# Altium schematic sheet STM and connectors.SchDoc
size A4
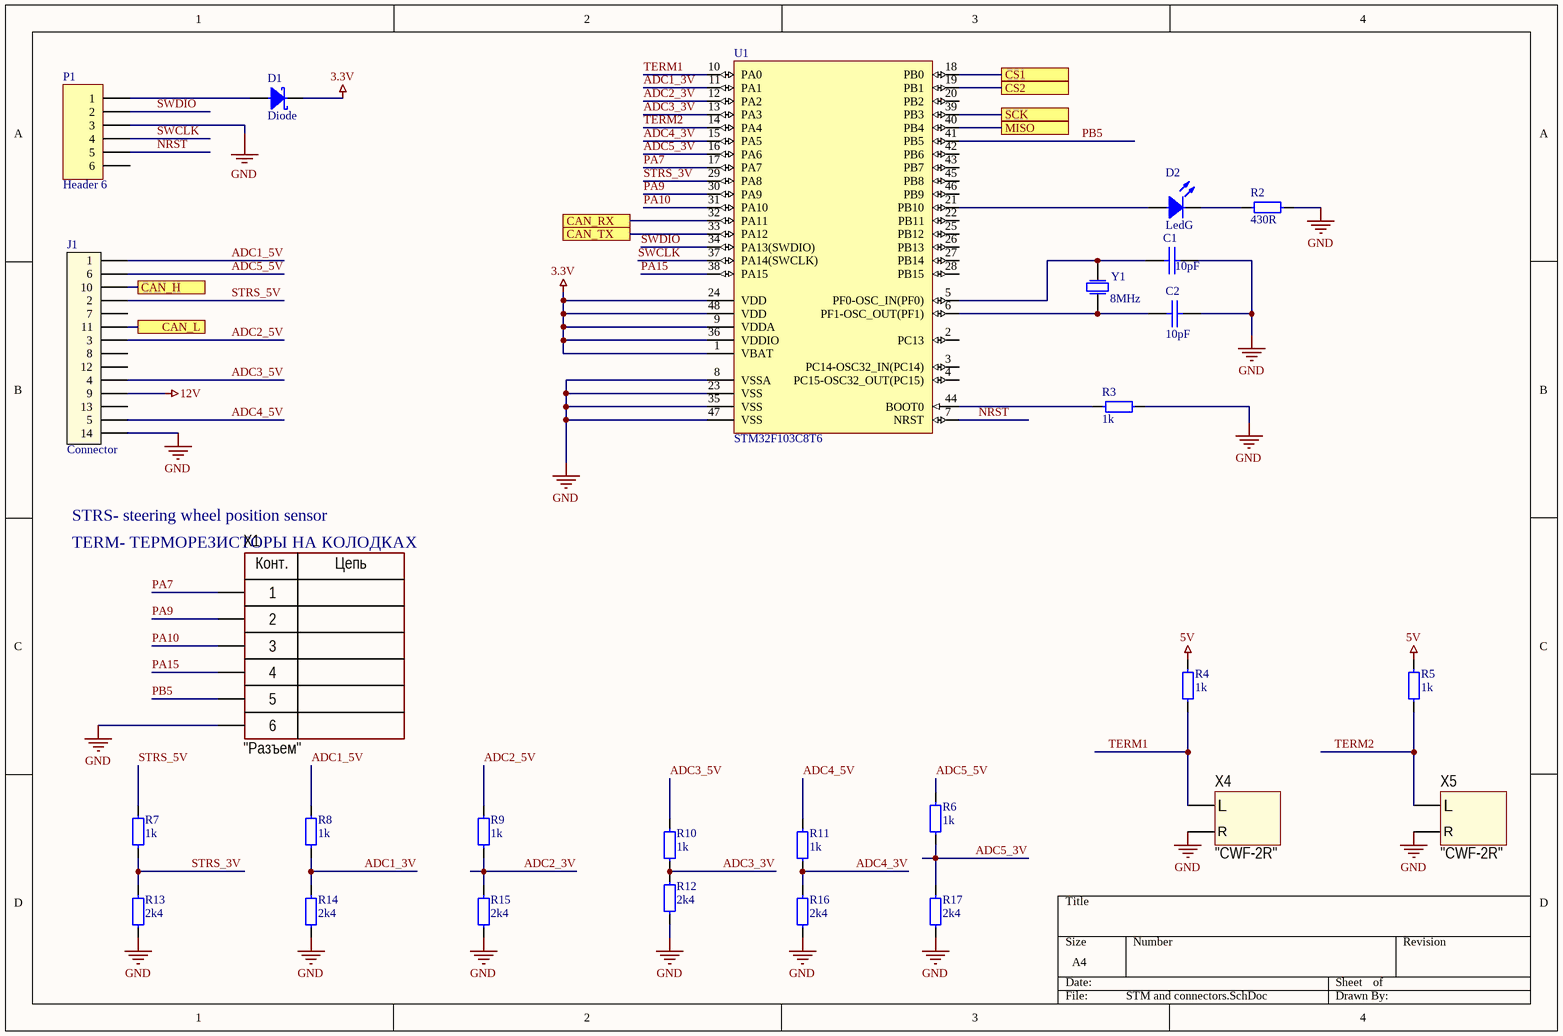
[diagram p0: STM and connectors.SchDoc]

## Parts
C1  10pF  [0805 Capicator]
C2  10pF  [0805 Capicator]
D1  Diode  [SMA]
D2  LedG  [0805 LED]
J1  Connector  [AMP 776266-1]
P1  Header 6  [HDR1X6]
R2  430R  [0805 Resistor]
R3  1k  [0805 Resistor]
R4  1k  [0805 Resistor]
R5  1k  [0805 Resistor]
R6  1k  [0805 Resistor]
R7  1k  [0805 Resistor]
R8  1k  [0805 Resistor]
R9  1k  [0805 Resistor]
R10  1k  [0805 Resistor]
R11  1k  [0805 Resistor]
R12  2k4  [0805 Resistor]
R13  2k4  [0805 Resistor]
R14  2k4  [0805 Resistor]
R15  2k4  [0805 Resistor]
R16  2k4  [0805 Resistor]
R17  2k4  [0805 Resistor]
U1  STM32F103C8T6  [LQFP48]
X1  CommentText: "Разъем"  [CON: PLD-6]
X4  CommentText: "CWF-2R"  [CON: CWF-2R]
X5  CommentText: "CWF-2R"  [CON: CWF-2R]
Y1  8MHz  [R38]

## Ports
CAN_H, CAN_L, CAN_RX, CAN_TX, CS1, CS2, MISO, SCK

## Nets
3.3V: D1.2 U1.1(VBAT) U1.9(VDDA) U1.24(VDD) U1.36(VDDIO) U1.48(VDD)
5V: R4.2 R5.2
12V: J1.9
GND: C1.2 C2.2 J1.14 P1.3 R2.2 R3.2 R12.2 R13.2 R14.2 R15.2 R16.2 R17.2 U1.8(VSSA) U1.23(VSS) U1.35(VSS) U1.47(VSS) X1.6 X4.2(R) X5.2(R)
ADC1_3V: R8.1 R14.1 U1.11(PA1)
ADC1_5V: J1.1 R8.2
ADC2_3V: R9.1 R15.1 U1.12(PA2)
ADC2_5V: J1.3 R9.2
ADC3_3V: R10.1 R12.1 U1.13(PA3)
ADC3_5V: J1.4 R10.2
ADC4_3V: R11.1 R16.1 U1.15(PA5)
ADC4_5V: J1.5 R11.2
ADC5_3V: R6.1 R17.1 U1.16(PA6)
ADC5_5V: J1.6 R6.2
CAN_H: J1.10 ; port CAN_H
CAN_L: J1.11 ; port CAN_L
CAN_RX: U1.32(PA11) ; port CAN_RX
CAN_TX: U1.33(PA12) ; port CAN_TX
CS1: U1.18(PB0) ; port CS1
CS2: U1.19(PB1) ; port CS2
MISO: U1.40(PB4) ; port MISO
NRST: P1.5 U1.7(NRST)
PA7: U1.17(PA7) X1.1
PA9: U1.30(PA9) X1.2
PA10: U1.31(PA10) X1.3
PA15: U1.38(PA15) X1.4
PB5: U1.41(PB5) X1.5
SCK: U1.39(PB3) ; port SCK
STRS_3V: R7.1 R13.1 U1.29(PA8)
STRS_5V: J1.2 R7.2
SWCLK: P1.4 U1.37(PA14(SWCLK))
SWDIO: P1.2 U1.34(PA13(SWDIO))
TERM1: R4.1 U1.10(PA0) X4.1(L)
TERM2: R5.1 U1.14(PA4) X5.1(L)
NetC1_1: C1.1 U1.5(PF0-OSC_IN(PF0)) Y1.2
NetC2_1: C2.1 U1.6(PF1-OSC_OUT(PF1)) Y1.1
NetD1_1: D1.1 P1.1
NetD2_1: D2.1 U1.21(PB10)
NetD2_2: D2.2 R2.1
NetR3_1: R3.1 U1.44(BOOT0)

Not connected (* = marked no-connect by the designer): J1 7 8 12 13; P1 6; U1 2(PC13) 3(PC14-OSC32_IN(PC14)) 4(PC15-OSC32_OUT(PC15)) 20(PB2) 22(PB11) 25(PB12) 26(PB13) 27(PB14) 28(PB15) 42(PB6) 43(PB7) 45(PB8) 46(PB9)

## Notes on the sheet
- STRS- steering wheel position sensor
- (near X1) TERM- ТЕРМОРЕЗИСТОРЫ НА КОЛОДКАХ
- (in symbol PLD-6) Конт.; Цепь

## Library data of the parts
C1 C2 = Cap 10pF (0805): 10pF NP0 50V 5% 0805; Manufacturer: Murata Manufacturing; Part Number: GRM2165C1H100JZ01D; Type: Capacitor; ComponentLink1Description: Chip&Dip; ComponentLink1URL: https://www.chipdip.ru/product/grm2165c1h100j
D1 = Diode Schottky (SMA): Diode Schottky 3A 40V; Part Number: B340A-E3/61T; Manufacturer: Vishay; Type: Diode; ComponentLink1Description: DataSheet; ComponentLink1URL: https://static.chipdip.ru/lib/652/DOC001652710.pdf; ComponentLink2Description: Chip&Dip; ComponentLink2URL: https://www.chipdip.ru/product/b340a-e3-61t-2
D2 = Led Green: Led Green SMD 1608, 120°, 525nM; Part Number: TO-1608BC-PG; Manufacturer: Taiwan Oasis Technology; Type: Diode; ComponentLink1Description: Chip&Dip; ComponentLink1URL: https://www.chipdip.ru/product/to-1608bc-pg
J1 = Connector AMP: AMP Connector; Part Number: 776266-1; Manufacturer: TE Connectivity; Type: Connector
P1 = Header 6: Header, 6-Pin; LatestRevisionDate: 17-Jul-2002; LatestRevisionNote: Re-released for DXP Platform.; Publisher: Altium Limited
R2 = Res 430R (0805): 0.125W 0805 430R, 1%; Part Number: RC0805FR-07430RL; Manufacturer: Taiwan; Type: Resistor; ComponentLink1Description: Chip&Dip; ComponentLink1URL: https://www.chipdip.ru/product0/9000079477
R3-R11 = Res 1k (0805): 0.125W 0805 1k, 1%; Part Number: RC0805FR-071KL; Manufacturer: Taiwan; Type: Resistor; ComponentLink1Description: Chip&Dip; ComponentLink1URL: https://www.chipdip.ru/product0/9000079486
R12-R17 = Res 2.4k (0805): 0.125W 0805 2.4k, 1%; Part Number: RC0805FR-072K4L; Manufacturer: Taiwan; Type: Resistor; ComponentLink1Description: Chip&Dip; ComponentLink1URL: https://www.chipdip.ru/product0/9000079495
U1 = STM32F103C8T6: Cortex™-M3 32-bit RISC core operating at a 72 MHz frequency; Manufacturer: STMicroelectronics; Part Number: STM32F103C8T6; ComponentLink1Description: DataSheet; ComponentLink1URL: https://static.chipdip.ru/lib/235/DOC000235733.pdf; ComponentLink2Description: Chip&Dip; ComponentLink2URL: https://www.chipdip.ru/product/stm32f103c8t6; Type: IC
X1 = PLD-6: Manufacturer: Connfly; ValueManufacturerPartNumber: Connector, 6pin, 2.54mm, 500VAC, 3A; TypeConnector: Connector; VoltageMax: 500VAC; Pitch: 2.54mm; CurrentMax: 3A; Multichannel: 6pin; HelpURL: https://www.chipdip.ru/product/pld-6; PartNumber: PLD-6
X4 X5 = CWF-2R: Manufacturer: Connfly; ValueManufacturerPartNumber: Connector, 2pin, 2.54mm, 250VAC, 3A; TypeConnector: Connector; VoltageMax: 250VAC; Pitch: 2.54mm; CurrentMax: 3A; Multichannel: 2pin; HelpURL: https://www.chipdip.ru/product/cwf-2r-ds1069-2-mr; PartNumber: CWF-2R; ComponentLink1Description: CHIP&DIP; ComponentLink1URL: https://www.chipdip.ru/product/cwf-2r-ds1069-2-mr
Y1 = Crystal 8MHz: Crystal. HC-49S (US); Manufacturer: China; Part Number: 8.000MHzHC-49US; Type: Crystal; ComponentLink1Description: Chip&Dip; ComponentLink1URL: https://www.chipdip.ru/product/8mhz-hc-49s